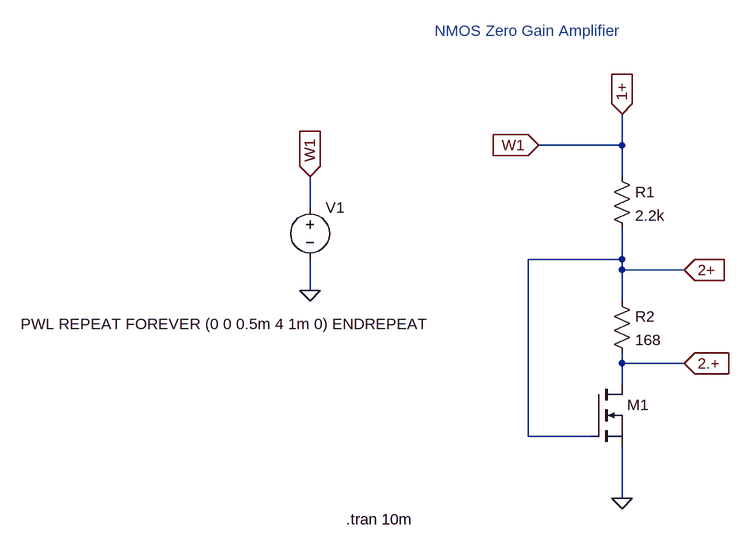
[diagram p0: schematic mos_zero_gain_ltspice.asc]
mos_zero_gain_ltspice.asc, the LTspice schematic file:
Version 4
SHEET 1 880 680
WIRE 144 -272 144 -320
WIRE 144 -272 16 -272
WIRE 144 -224 144 -272
WIRE -336 -176 -336 -224
WIRE 144 -96 144 -144
WIRE 144 -96 0 -96
WIRE 144 -80 144 -96
WIRE 240 -80 144 -80
WIRE -336 -48 -336 -96
WIRE 144 -32 144 -80
WIRE 144 64 144 48
WIRE 240 64 144 64
WIRE 144 96 144 64
WIRE 0 176 0 -96
WIRE 96 176 0 176
WIRE 144 272 144 192
FLAG 144 272 0
FLAG 16 -272 W1
IOPIN 16 -272 In
FLAG -336 -48 0
FLAG -336 -224 W1
IOPIN -336 -224 In
FLAG 144 -320 1+
IOPIN 144 -320 In
FLAG 240 -80 2+
IOPIN 240 -80 In
FLAG 240 64 2.+
IOPIN 240 64 In
SYMBOL res 128 -240 R0
SYMATTR InstName R1
SYMATTR Value 2.2k
SYMBOL res 128 -48 R0
SYMATTR InstName R2
SYMATTR Value 168
SYMBOL voltage -336 -192 R0
WINDOW 3 -445 195 Left 2
WINDOW 123 0 0 Left 0
WINDOW 39 0 0 Left 0
SYMATTR Value PWL REPEAT FOREVER (0 0 0.5m 4 1m 0) ENDREPEAT
SYMATTR InstName V1
SYMBOL nmos 96 96 R0
WINDOW 3 56 72 Invisible 2
SYMATTR Value BSP89
SYMATTR InstName M1
TEXT -280 304 Left 2 !.tran 10m
TEXT -144 -448 Left 2 ;NMOS Zero Gain Amplifier

The netlist it stands for:
* mos_zero_gain_ltspice.asc
R1 1+ 2+ 2.2k
R2 2+ 2.+ 168
V1 1+ 0 PWL REPEAT FOREVER (0 0 0.5m 4 1m 0) ENDREPEAT
M1 2.+ 2+ 0 0 BSP89
.model NMOS NMOS
.model PMOS PMOS
.lib standard.mos
.tran 10m
* NMOS Zero Gain Amplifier
.backanno
.end